# EAGLE schematic BT60-soldered (EAGLE 9.6.2)
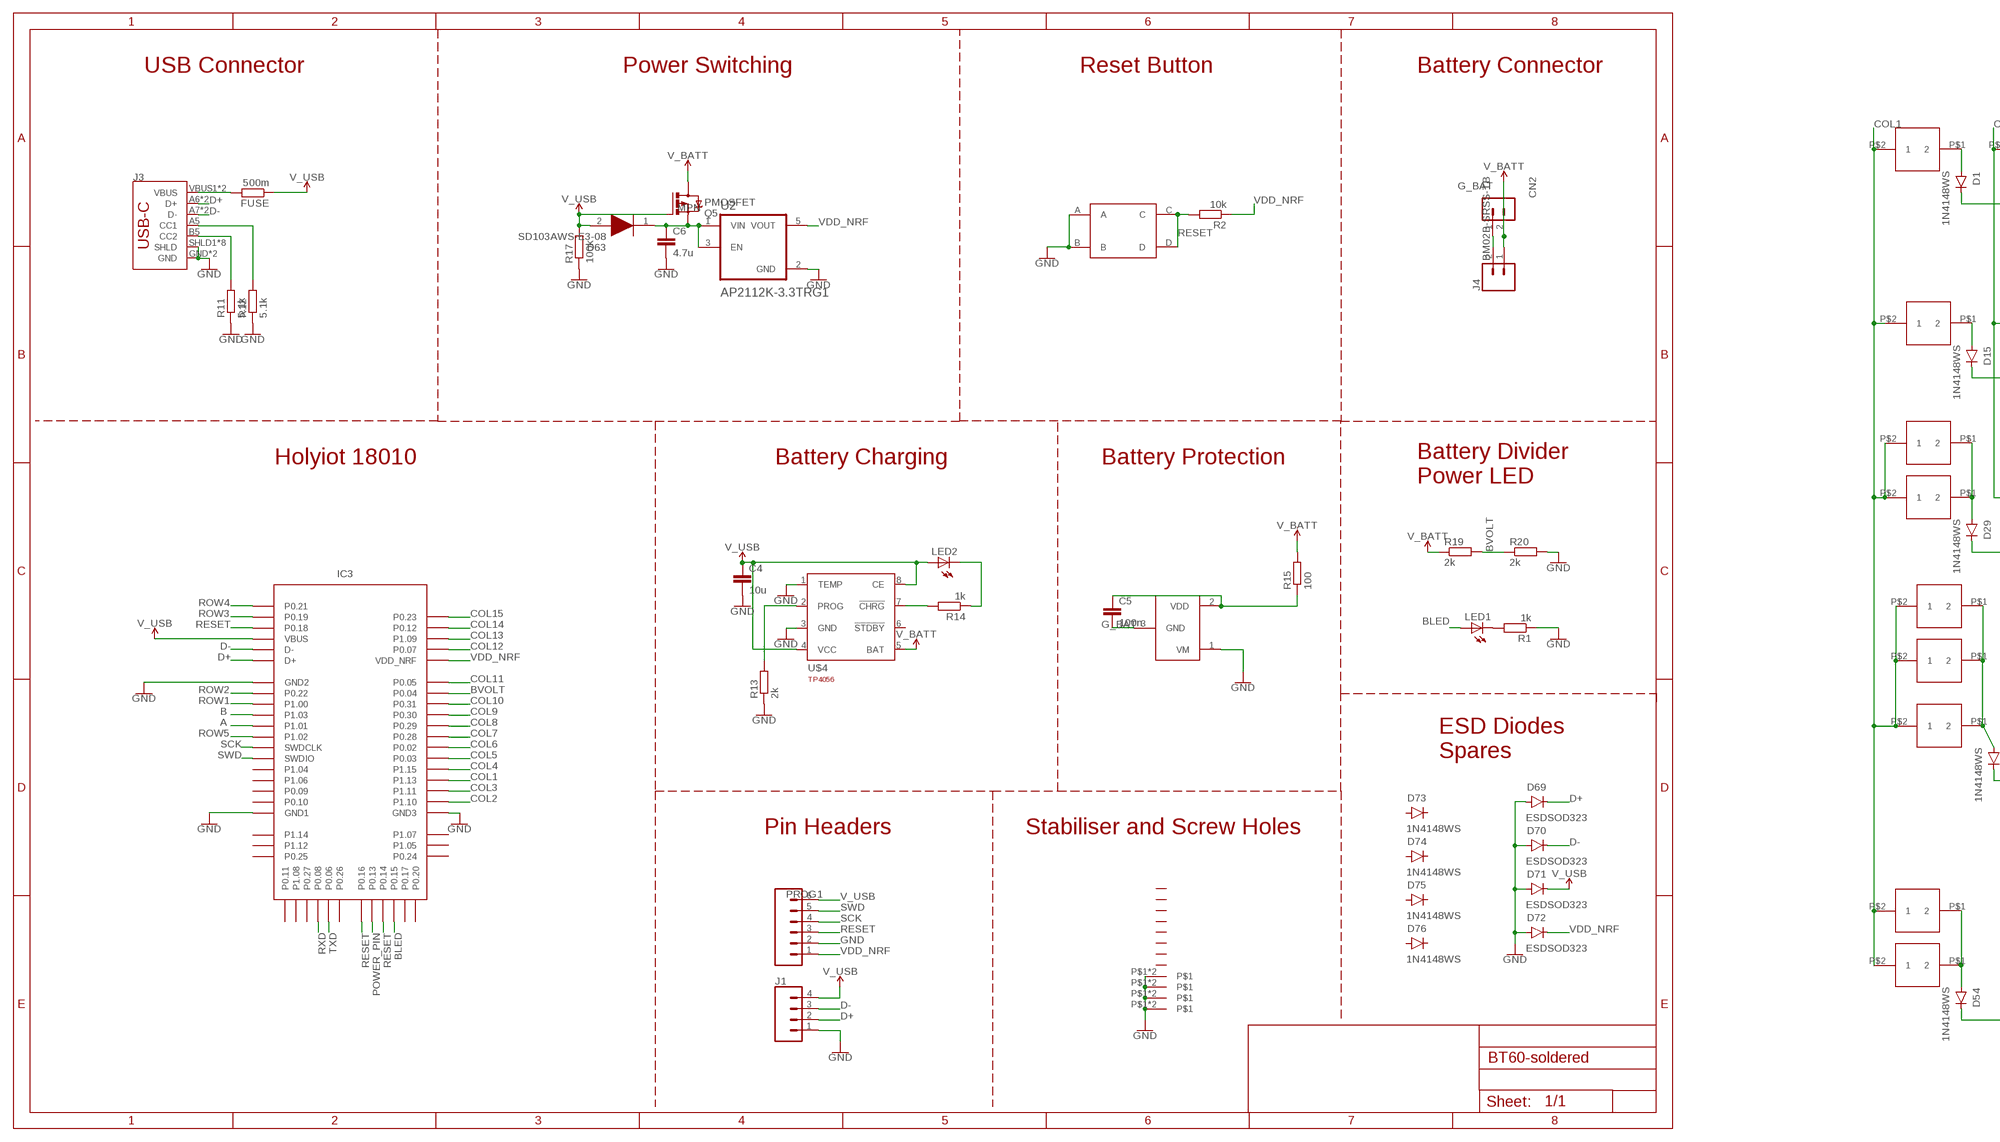
[diagram p0: schematic, sheet 1, part 1 of 2]
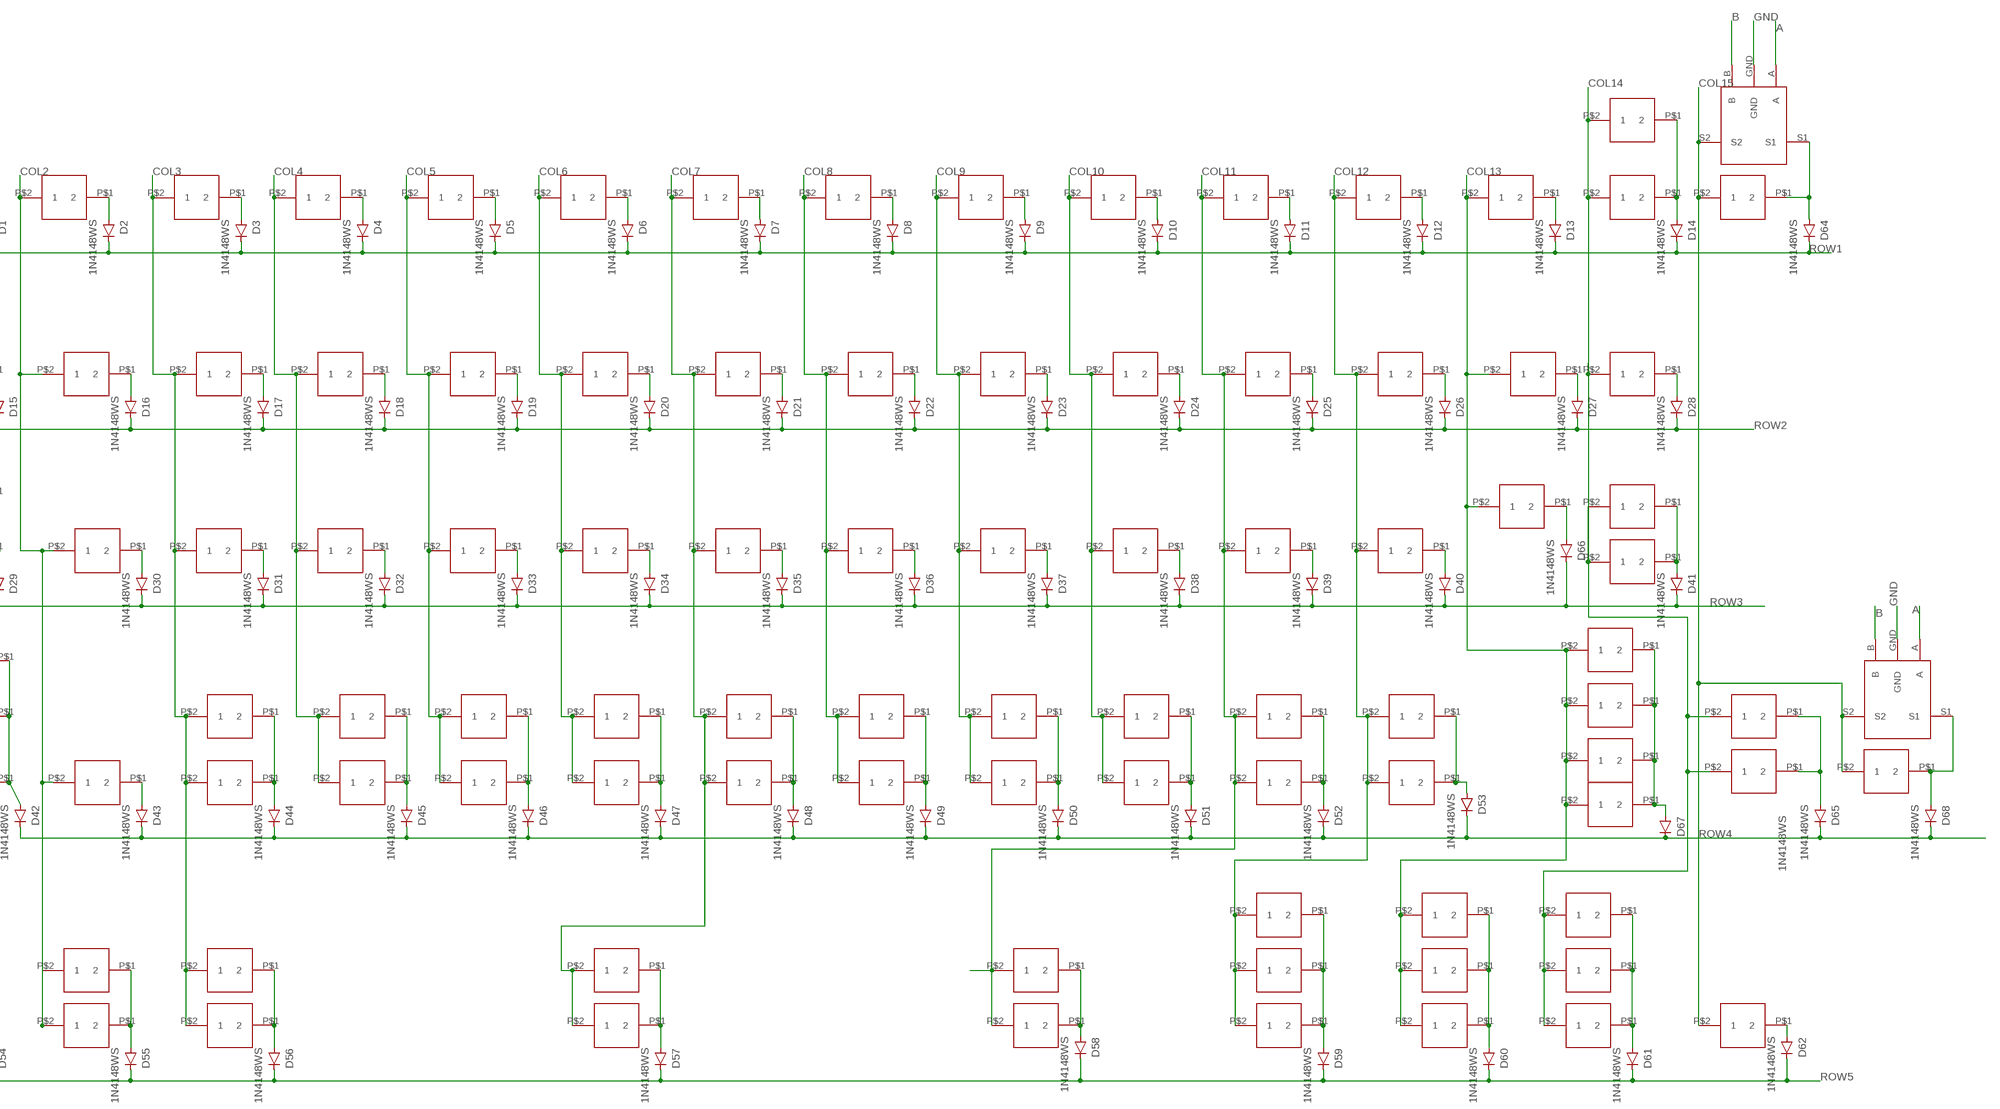
[diagram p1: schematic, sheet 1, part 2 of 2]

## Parts
0  CHERRY-SOLDER  [CHERRY-SOLDER]
1  CHERRY-SOLDER  [CHERRY-SOLDER]
1U_1  CHERRY-SOLDER  [CHERRY-SOLDER]
1U_2  CHERRY-SOLDER  [CHERRY-SOLDER]
1U_3  CHERRY-SOLDER  [CHERRY-SOLDER]
1U_4  CHERRY-SOLDER  [CHERRY-SOLDER]
1U_5  CHERRY-SOLDER  [CHERRY-SOLDER]
2  CHERRY-SOLDER  [CHERRY-SOLDER]
3  CHERRY-SOLDER  [CHERRY-SOLDER]
4  CHERRY-SOLDER  [CHERRY-SOLDER]
5  CHERRY-SOLDER  [CHERRY-SOLDER]
6  CHERRY-SOLDER  [CHERRY-SOLDER]
7  CHERRY-SOLDER  [CHERRY-SOLDER]
8  CHERRY-SOLDER  [CHERRY-SOLDER]
9  CHERRY-SOLDER  [CHERRY-SOLDER]
#_ISO  CHERRY-SOLDER  [CHERRY-SOLDER]
'  CHERRY-SOLDER  [CHERRY-SOLDER]
,  CHERRY-SOLDER  [CHERRY-SOLDER]
,_1  CHERRY-SOLDER  [CHERRY-SOLDER]
-  CHERRY-SOLDER  [CHERRY-SOLDER]
.  CHERRY-SOLDER  [CHERRY-SOLDER]
._1  CHERRY-SOLDER  [CHERRY-SOLDER]
/  CHERRY-SOLDER  [CHERRY-SOLDER]
/_1  CHERRY-SOLDER  [CHERRY-SOLDER]
=  CHERRY-SOLDER  [CHERRY-SOLDER]
[  CHERRY-SOLDER  [CHERRY-SOLDER]
\  CHERRY-SOLDER  [CHERRY-SOLDER]
]  CHERRY-SOLDER  [CHERRY-SOLDER]
A  CHERRY-SOLDER  [CHERRY-SOLDER]
B  CHERRY-SOLDER  [CHERRY-SOLDER]
B_1  CHERRY-SOLDER  [CHERRY-SOLDER]
BS  CHERRY-SOLDER  [CHERRY-SOLDER]
C  CHERRY-SOLDER  [CHERRY-SOLDER]
C4  10u  C-EUC0603  [C0603]
C5  100n  C-EUC0603  [C0603]
C6  4.7u  C-EUC0603  [C0603]
C_1  CHERRY-SOLDER  [CHERRY-SOLDER]
CAPS  CHERRY-SOLDER  [CHERRY-SOLDER]
CAPS_STEP  CHERRY-SOLDER  [CHERRY-SOLDER]
CN2  BM02B-SRSS-TB  [BM02B-SRSS-TB]
COLON  CHERRY-SOLDER  [CHERRY-SOLDER]
D  CHERRY-SOLDER  [CHERRY-SOLDER]
D1  1N4148WS  [SOD-323]
D2  1N4148WS  [SOD-323]
D3  1N4148WS  [SOD-323]
D4  1N4148WS  [SOD-323]
D5  1N4148WS  [SOD-323]
D6  1N4148WS  [SOD-323]
D7  1N4148WS  [SOD-323]
D8  1N4148WS  [SOD-323]
D9  1N4148WS  [SOD-323]
D10  1N4148WS  [SOD-323]
D11  1N4148WS  [SOD-323]
D12  1N4148WS  [SOD-323]
D13  1N4148WS  [SOD-323]
D14  1N4148WS  [SOD-323]
D15  1N4148WS  [SOD-323]
D16  1N4148WS  [SOD-323]
D17  1N4148WS  [SOD-323]
D18  1N4148WS  [SOD-323]
D19  1N4148WS  [SOD-323]
D20  1N4148WS  [SOD-323]
D21  1N4148WS  [SOD-323]
D22  1N4148WS  [SOD-323]
D23  1N4148WS  [SOD-323]
D24  1N4148WS  [SOD-323]
D25  1N4148WS  [SOD-323]
D26  1N4148WS  [SOD-323]
D27  1N4148WS  [SOD-323]
D28  1N4148WS  [SOD-323]
D29  1N4148WS  [SOD-323]
D30  1N4148WS  [SOD-323]
D31  1N4148WS  [SOD-323]
D32  1N4148WS  [SOD-323]
D33  1N4148WS  [SOD-323]
D34  1N4148WS  [SOD-323]
D35  1N4148WS  [SOD-323]
D36  1N4148WS  [SOD-323]
D37  1N4148WS  [SOD-323]
D38  1N4148WS  [SOD-323]
D39  1N4148WS  [SOD-323]
D40  1N4148WS  [SOD-323]
D41  1N4148WS  [SOD-323]
D42  1N4148WS  [SOD-323]
D43  1N4148WS  [SOD-323]
D44  1N4148WS  [SOD-323]
D45  1N4148WS  [SOD-323]
D46  1N4148WS  [SOD-323]
D47  1N4148WS  [SOD-323]
D48  1N4148WS  [SOD-323]
D49  1N4148WS  [SOD-323]
D50  1N4148WS  [SOD-323]
D51  1N4148WS  [SOD-323]
D52  1N4148WS  [SOD-323]
D53  1N4148WS  [SOD-323]
D54  1N4148WS  [SOD-323]
D55  1N4148WS  [SOD-323]
D56  1N4148WS  [SOD-323]
D57  1N4148WS  [SOD-323]
D58  1N4148WS  [SOD-323]
D59  1N4148WS  [SOD-323]
D60  1N4148WS  [SOD-323]
D61  1N4148WS  [SOD-323]
D62  1N4148WS  [SOD-323]
D63  SD103AWS-E3-08  [SOD2713X115N]
D64  1N4148WS  [SOD-323]
D65  1N4148WS  [SOD-323]
D66  1N4148WS  [SOD-323]
D67  1N4148WS  [SOD-323]
D68  1N4148WS  [SOD-323]
D69  ESDSOD323  [SOD-323]
D70  ESDSOD323  [SOD-323]
D71  ESDSOD323  [SOD-323]
D72  ESDSOD323  [SOD-323]
D73  1N4148WS  [SOD-323]
D74  1N4148WS  [SOD-323]
D75  1N4148WS  [SOD-323]
D76  1N4148WS  [SOD-323]
E  CHERRY-SOLDER  [CHERRY-SOLDER]
ENTER  CHERRY-SOLDER  [CHERRY-SOLDER]
ESC  CHERRY-SOLDER  [CHERRY-SOLDER]
EXTRA_1U_LEFT  CHERRY-SOLDER  [CHERRY-SOLDER]
F  CHERRY-SOLDER  [CHERRY-SOLDER]
FN  CHERRY-SOLDER  [CHERRY-SOLDER]
FUSE  500m  R-EU_R0603  [R0603]
G  CHERRY-SOLDER  [CHERRY-SOLDER]
H  CHERRY-SOLDER  [CHERRY-SOLDER]
I  CHERRY-SOLDER  [CHERRY-SOLDER]
IC3  HOLYIOT_18010  [PCBCOMPONENT_1]
ISO_#  CHERRY-SOLDER  [CHERRY-SOLDER]
ISO_ENTER  CHERRY-SOLDER  [CHERRY-SOLDER]
J  CHERRY-SOLDER  [CHERRY-SOLDER]
J1  CONN_041X04_NO_SILK  [1X04_NO_SILK]
J3  SPARKFUN-CONNECTORS_USB_C16PIN  [SPARKFUN-CONNECTORS_USB-C-16P]
J4  CONN_02  [1X02]
K  CHERRY-SOLDER  [CHERRY-SOLDER]
L  CHERRY-SOLDER  [CHERRY-SOLDER]
L_1.25U_SHIFT  CHERRY-SOLDER  [CHERRY-SOLDER]
L_2U_SHIFT  CHERRY-SOLDER  [CHERRY-SOLDER]
L_SHIFT  CHERRY-SOLDER  [CHERRY-SOLDER]
LALT  CHERRY-SOLDER  [CHERRY-SOLDER]
LALT_1.5U  CHERRY-SOLDER  [CHERRY-SOLDER]
LCTRL  CHERRY-SOLDER  [CHERRY-SOLDER]
LCTRL_1.5U  CHERRY-SOLDER  [CHERRY-SOLDER]
LED1  LEDCHIPLED_0805  [CHIPLED_0805]
LED2  LEDCHIPLED_0805  [CHIPLED_0805]
LWIN  CHERRY-SOLDER  [CHERRY-SOLDER]
LWIN_1U  CHERRY-SOLDER  [CHERRY-SOLDER]
M  CHERRY-SOLDER  [CHERRY-SOLDER]
M_1  CHERRY-SOLDER  [CHERRY-SOLDER]
MENU  CHERRY-SOLDER  [CHERRY-SOLDER]
MENU_1U  CHERRY-SOLDER  [CHERRY-SOLDER]
N  CHERRY-SOLDER  [CHERRY-SOLDER]
N_1  CHERRY-SOLDER  [CHERRY-SOLDER]
O  CHERRY-SOLDER  [CHERRY-SOLDER]
P  CHERRY-SOLDER  [CHERRY-SOLDER]
PROG1  CONN_06NO_SILK_FEMALE_PTH  [1X06_NO_SILK]
Q  CHERRY-SOLDER  [CHERRY-SOLDER]
Q5  PMOSFET  PMOSFET_SOT23  [SOT23]
R  CHERRY-SOLDER  [CHERRY-SOLDER]
R1  1k  R-EU_R0603  [R0603]
R2  10k  R-EU_R0603  [R0603]
R11  5.1k  R-EU_R0603  [R0603]
R12  5.1k  R-EU_R0603  [R0603]
R13  2k  R-EU_R0603  [R0603]
R14  1k  R-EU_R0603  [R0603]
R15  100  R-EU_R0603  [R0603]
R17  100k  R-EU_R0603  [R0603]
R19  2k  R-EU_R0603  [R0603]
R20  2k  R-EU_R0603  [R0603]
R_ALT_1.5  CHERRY-SOLDER  [CHERRY-SOLDER]
R_CTRL_1.5U  CHERRY-SOLDER  [CHERRY-SOLDER]
R_SHIFT  CHERRY-SOLDER  [CHERRY-SOLDER]
R_SHIFT_1.75U_LEFT  CHERRY-SOLDER  [CHERRY-SOLDER]
R_SHIFT_1.75U_RIGHT  CHERRY-SOLDER  [CHERRY-SOLDER]
RALT  CHERRY-SOLDER  [CHERRY-SOLDER]
RCTRL  CHERRY-SOLDER  [CHERRY-SOLDER]
S  CHERRY-SOLDER  [CHERRY-SOLDER]
SPACE_6.25U  CHERRY-SOLDER  [CHERRY-SOLDER]
SPACE_7U  CHERRY-SOLDER  [CHERRY-SOLDER]
SPLIT_BS_1  CHERRY-SOLDER  [CHERRY-SOLDER]
SPLIT_BS_2  CHERRY-SOLDER  [CHERRY-SOLDER]
T  CHERRY-SOLDER  [CHERRY-SOLDER]
TAB  CHERRY-SOLDER  [CHERRY-SOLDER]
U  CHERRY-SOLDER  [CHERRY-SOLDER]
U2  AP2112K-3.3TRG1  [SOT95P285X140-5N]
U$1  CHERRY-ENCODER  [CHERRY-ENCODER]
U$2  CHERRY-ENCODER  [CHERRY-ENCODER]
U$3  XB3303ASOT23  [SOT23-3]
U$4  TP4056SOI8  [SOIC8]
U$62  SMD-BUTTON  [SMD-BUTTON]
U$64  2.5MM_ELONGATED  [2.5MM_ELONGATED]
U$65  2.5MM_ELONGATED  [2.5MM_ELONGATED]
U$66  2.5MM_ELONGATED  [2.5MM_ELONGATED]
U$67  2.5MM_ELONGATED  [2.5MM_ELONGATED]
U$68  STAB-2U  [STAB-2U]
U$69  STAB-2U  [STAB-2U]
U$70  STAB-2U  [STAB-2U]
U$71  STAB-2U  [STAB-2U]
U$72  STAB-6U  [STAB-6.25U]
U$83  STAB-2U  [STAB-2U]
U$91  STAB-7U  [STAB-7U]
U$108  STAB-2U  [STAB-2U]
UP  CHERRY-SOLDER  [CHERRY-SOLDER]
V  CHERRY-SOLDER  [CHERRY-SOLDER]
V_1  CHERRY-SOLDER  [CHERRY-SOLDER]
W  CHERRY-SOLDER  [CHERRY-SOLDER]
X  CHERRY-SOLDER  [CHERRY-SOLDER]
X5U_1  CHERRY-SOLDER  [CHERRY-SOLDER]
X5U_2  CHERRY-SOLDER  [CHERRY-SOLDER]
X_1  CHERRY-SOLDER  [CHERRY-SOLDER]
Y  CHERRY-SOLDER  [CHERRY-SOLDER]
Z  CHERRY-SOLDER  [CHERRY-SOLDER]
Z_1  CHERRY-SOLDER  [CHERRY-SOLDER]

## Nets
A: IC3.P1.01 U$1.A U$2.A
B: IC3.P1.03 U$1.B U$2.B
BLED: IC3.P0.15 LED1.A
BVOLT: IC3.P0.04 R19.2 R20.1
COL1: CAPS.P$2 CAPS_STEP.P$2 ESC.P$2 IC3.P1.13 L_1.25U_SHIFT.P$2 L_2U_SHIFT.P$2 L_SHIFT.P$2 LCTRL.P$2 LCTRL_1.5U.P$2 TAB.P$2
COL2: 1.P$2 #_ISO.P$2 A.P$2 IC3.P1.10 LWIN.P$2 LWIN_1U.P$2 Q.P$2
COL3: 2.P$2 IC3.P1.11 LALT.P$2 LALT_1.5U.P$2 S.P$2 W.P$2 Z.P$2 Z_1.P$2
COL4: 3.P$2 D.P$2 E.P$2 IC3.P1.15 X.P$2 X_1.P$2
COL5: 4.P$2 C.P$2 C_1.P$2 F.P$2 IC3.P0.03 R.P$2
COL6: 5.P$2 G.P$2 IC3.P0.02 T.P$2 V.P$2 V_1.P$2
COL7: 6.P$2 B.P$2 B_1.P$2 H.P$2 IC3.P0.28 SPACE_6.25U.P$2 SPACE_7U.P$2 Y.P$2
COL8: 7.P$2 IC3.P0.29 J.P$2 N.P$2 N_1.P$2 U.P$2
COL9: 8.P$2 I.P$2 IC3.P0.30 K.P$2 M.P$2 M_1.P$2
COL10: 9.P$2 ,.P$2 ,_1.P$2 IC3.P0.31 L.P$2 O.P$2
COL11: 0.P$2 1U_1.P$2 ..P$2 ._1.P$2 COLON.P$2 IC3.P0.05 P.P$2 RALT.P$2
COL12: 1U_2.P$2 '.P$2 -.P$2 /.P$2 /_1.P$2 [.P$2 IC3.P0.07 MENU.P$2 R_ALT_1.5.P$2
COL13: 1U_3.P$2 =.P$2 ].P$2 EXTRA_1U_LEFT.P$2 IC3.P1.09 ISO_#.P$2 MENU_1U.P$2 R_SHIFT.P$2 R_SHIFT_1.75U_LEFT.P$2 RCTRL.P$2 UP.P$2
COL14: 1U_4.P$2 \.P$2 BS.P$2 ENTER.P$2 FN.P$2 IC3.P0.12 ISO_ENTER.P$2 R_CTRL_1.5U.P$2 R_SHIFT_1.75U_RIGHT.P$2 SPLIT_BS_1.P$2 X5U_1.P$2
COL15: 1U_5.P$2 IC3.P0.23 SPLIT_BS_2.P$2 U$1.S2 U$2.S2 X5U_2.P$2
D+: D69.C IC3.D+ J1.2 J3.A6(D+) J3.B6(D+)
D-: D70.C IC3.D- J1.3 J3.A7(D-) J3.B7(D-)
G_BAT: C5.2 CN2.1 J4.2 U$3.3(GND)
GND: C4.2 C6.2 D69.A D70.A D71.A D72.A IC3.GND1(GND2) IC3.GND2(GND3) IC3.GND(GND1) J1.1 J3.GND J3.GND2(GND) J3.SHLD1(SHLD) J3.SHLD2(SHLD) J3.SHLD3(SHLD) J3.SHLD4(SHLD) J3.SHLD5(SHLD) J3.SHLD6(SHLD) J3.SHLD7(SHLD) J3.SHLD8(SHLD) PROG1.2 R1.1 R11.1 R12.1 R13.1 R17.1 R20.2 U2.2(GND) U$1.GND U$2.GND U$3.1(VM) U$4.1(TEMP) U$4.3(GND) U$62.A U$62.B U$64.P$1 U$64.P$2 U$65.P$1 U$65.P$2 U$66.P$1 U$66.P$2 U$67.P$1 U$67.P$2
N$1: D1.A ESC.P$1
N$2: LED1.C R1.2
N$3: 1U_5.P$1 D62.A
N$4: =.P$1 D13.A
N$5: -.P$1 D12.A
N$6: 0.P$1 D11.A
N$7: 9.P$1 D10.A
N$8: 8.P$1 D9.A
N$9: 7.P$1 D8.A
N$10: 6.P$1 D7.A
N$11: 5.P$1 D6.A
N$12: 4.P$1 D5.A
N$13: 3.P$1 D4.A
N$14: 2.P$1 D3.A
N$15: 1.P$1 D2.A
N$16: D15.A TAB.P$1
N$17: D45.A X.P$1 X_1.P$1
N$18: \.P$1 D28.A
N$19: ].P$1 D27.A
N$20: [.P$1 D26.A
N$21: D25.A P.P$1
N$22: D24.A O.P$1
N$23: D23.A I.P$1
N$24: D22.A U.P$1
N$25: D21.A Y.P$1
N$26: D20.A T.P$1
N$27: D19.A R.P$1
N$28: D18.A E.P$1
N$29: D17.A W.P$1
N$30: D16.A Q.P$1
N$31: D47.A V.P$1 V_1.P$1
N$32: ,.P$1 ,_1.P$1 D51.A
N$33: D41.A ENTER.P$1 ISO_ENTER.P$1
N$34: '.P$1 D40.A
N$35: COLON.P$1 D39.A
N$36: D38.A L.P$1
N$37: D37.A K.P$1
N$38: D36.A J.P$1
N$39: D35.A H.P$1
N$40: D34.A G.P$1
N$41: D33.A F.P$1
N$42: D32.A D.P$1
N$43: D31.A S.P$1
N$44: A.P$1 D30.A
N$45: D42.A L_1.25U_SHIFT.P$1 L_2U_SHIFT.P$1 L_SHIFT.P$1
N$46: ..P$1 ._1.P$1 D52.A
N$47: D67.A EXTRA_1U_LEFT.P$1 R_SHIFT.P$1 R_SHIFT_1.75U_LEFT.P$1 UP.P$1
N$48: D68.A U$2.S1 X5U_2.P$1
N$49: D64.A SPLIT_BS_2.P$1 U$1.S1
N$50: C5.1 R15.1 U$3.2(VDD)
N$52: #_ISO.P$1 D43.A
N$53: D44.A Z.P$1 Z_1.P$1
N$54: B.P$1 B_1.P$1 D48.A
N$55: C.P$1 C_1.P$1 D46.A
N$56: D49.A N.P$1 N_1.P$1
N$57: D50.A M.P$1 M_1.P$1
N$58: D54.A LCTRL.P$1 LCTRL_1.5U.P$1
N$59: /.P$1 /_1.P$1 D53.A
N$60: 1U_4.P$1 D61.A FN.P$1 R_CTRL_1.5U.P$1
N$61: 1U_3.P$1 D60.A MENU_1U.P$1 RCTRL.P$1
N$62: 1U_2.P$1 D59.A MENU.P$1 R_ALT_1.5.P$1
N$63: 1U_1.P$1 D58.A RALT.P$1
N$64: D57.A SPACE_6.25U.P$1 SPACE_7U.P$1
N$65: D56.A LALT.P$1 LALT_1.5U.P$1
N$66: D55.A LWIN.P$1 LWIN_1U.P$1
N$67: FUSE.2 J3.VBUS1(VBUS) J3.VBUS2(VBUS)
N$68: BS.P$1 D14.A SPLIT_BS_1.P$1
N$71: D66.A ISO_#.P$1
N$72: J3.B5(CC2) R11.2
N$73: J3.A5(CC1) R12.2
N$74: R13.2 U$4.2(PROG)
N$75: LED2.C R14.1
N$76: R14.2 U$4.7(!CHRG)
N$81: C6.1 D63.1(K) Q5.2(S) U2.1(VIN) U2.3(EN)
N$82: CAPS.P$1 CAPS_STEP.P$1 D29.A
N$83: D65.A R_SHIFT_1.75U_RIGHT.P$1 X5U_1.P$1
POWER_PIN: IC3.P0.13
RESET: IC3.P0.14 IC3.P0.16 IC3.P0.18 PROG1.3 R2.2 U$62.C U$62.D
ROW1: D1.C D2.C D3.C D4.C D5.C D6.C D7.C D8.C D9.C D10.C D11.C D12.C D13.C D14.C D64.C IC3.P1.00
ROW2: D15.C D16.C D17.C D18.C D19.C D20.C D21.C D22.C D23.C D24.C D25.C D26.C D27.C D28.C IC3.P0.22
ROW3: D29.C D30.C D31.C D32.C D33.C D34.C D35.C D36.C D37.C D38.C D39.C D40.C D41.C D66.C IC3.P0.19
ROW4: D42.C D43.C D44.C D45.C D46.C D47.C D48.C D49.C D50.C D51.C D52.C D53.C D65.C D67.C D68.C IC3.P0.21
ROW5: D54.C D55.C D56.C D57.C D58.C D59.C D60.C D61.C D62.C IC3.P1.02
RXD: IC3.P0.08
SCK: IC3.SWDCLK PROG1.4
SWD: IC3.SWDIO PROG1.5
TXD: IC3.P0.06
V_BATT: CN2.2 J4.1 Q5.3(D) R15.2 R19.1 U$4.5(BAT)
V_USB: C4.1 D63.2(A) D71.C FUSE.1 IC3.VBUS J1.4 LED2.A PROG1.6 Q5.1(G) R17.2 U$4.4(VCC) U$4.8(CE)
VDD_NRF: D72.C IC3.VDD_NRF PROG1.1 R2.1 U2.5(VOUT)
Unconnected: D73.A D73.C D74.A D74.C D75.A D75.C D76.A D76.C IC3.P0.09 IC3.P0.10 IC3.P0.11 IC3.P0.17 IC3.P0.20 IC3.P0.24 IC3.P0.25 IC3.P0.26 IC3.P0.27 IC3.P1.04 IC3.P1.05 IC3.P1.06 IC3.P1.07 IC3.P1.08 IC3.P1.12 IC3.P1.14 U$4.6(!STDBY)

## Notes on the sheet
- USB Connector | Power Switching | Reset Button | Battery Connector
- Holyiot 18010 | Battery Charging | Battery Protection
- Battery Divider
  Power LED
- ESD Diodes
  Spares
- Pin Headers | Stabiliser and Screw Holes

## Library data of the parts
0 1 1U_1-1U_5 2-9 #_ISO ' , ,_1 - . ._1 / /_1 = [ \ ] A B B_1 BS C C_1 CAPS CAPS_STEP COLON D E ENTER ESC EXTRA_1U_LEFT F FN G H I ISO_# ISO_ENTER J K L L_1.25U_SHIFT L_2U_SHIFT L_SHIFT LALT LALT_1.5U LCTRL LCTRL_1.5U LWIN LWIN_1U M M_1 MENU MENU_1U N N_1 O P Q R R_ALT_1.5 R_CTRL_1.5U R_SHIFT R_SHIFT_1.75U_LEFT R_SHIFT_1.75U_RIGHT RALT RCTRL S SPACE_6.25U SPACE_7U SPLIT_BS_1 SPLIT_BS_2 T TAB U UP V V_1 W X X5U_1 X5U_2 X_1 Y Z Z_1 = Volume_V1:CHERRY-SOLDER
C4-C6 = resistor:C-EU: CAPACITOR, European symbol
CN2 = con-JST SH:BM02B-SRSS: JST SH series header 1.00mm pitch disconnectable crimp style connectors, vertical (side entry type), 2 pins
D1-D62 D64-D68 D73-D76 = Diodes:1N4148WS: DIODE GEN PURP 75V 150MA SOD323F Manufacturer's datasheet <https://www.onsemi.com/pub/Collateral/1N914BWS-D.pdf>; CREATED_BY: PCBLayout.com; DIGIKEY_PART_NUMBER: 1N4148WSFSTR-ND; MANUFACTURER: Diodes Incorporated; MPN: 1N4148WS; PACKAGE: SOD-323
D63 = SD103AWS-E3-08:SD103AWS-E3-08: Vishay SD103AWS-E3-08, SMT Schottky Diode, 40V 350mA, 10ns, 2-Pin SOD-323 Source: Datasheet <http://www.vishay.com/docs/85682/sd103aws.pdf>; ARROW_PART_NUMBER: SD103AWS-E3-08; ARROW_PRICE-STOCK: https://www.arrow.com/en/products/sd103aws-e3-08/vishay; DESCRIPTION: Vishay SD103AWS-E3-08, SMT Schottky Diode, 40V 350mA, 10ns, 2-Pin SOD-323; HEIGHT: 1.15mm; MANUFACTURER_NAME: Vishay; MANUFACTURER_PART_NUMBER: SD103AWS-E3-08; MOUSER_PART_NUMBER: 78-SD103AWS-E3-08; MOUSER_PRICE-STOCK: https://www.mouser.co.uk/ProductDetail/Vishay-Semiconductors/SD103AWS-E3-08?qs=S660mHfF5o1xcba7ic5A%252BA%3D%3D
D69-D72 = Volume_V1:ESDSOD323: DIODE GEN PURP 75V 150MA SOD323F Manufacturer's datasheet <https://www.onsemi.com/pub/Collateral/1N914BWS-D.pdf>; CREATED_BY: PCBLayout.com; MANUFACTURER: Diodes Incorporated; PACKAGE: SOD-323
FUSE R1 R2 R11-R15 R17 R19 R20 = rcl:R-EU_: RESISTOR, European symbol; SPICEPREFIX: R
IC3 = HOLYIOT-18010-VER1.0-0.8MM:HOLYIOT_18010
J1 = SparkFun-Connectors:CONN_04: Multi connection point. Often used as Generic Header-pin footprint for 0.1 inch spaced/style header connections On any of the 0.1 inch spaced packages, you can populate with these: Break Away Headers - Straight <https://www.sparkfun.com/products/116> (PRT-00116) Break Away Male Headers - Right Angle <https://www.sparkfun.com/products/553> (PRT-00553) Female Headers <https://www.sparkfun.com/products/115> (PRT-00115) Break Away Headers - Machine Pin <https://www.sparkfun.com/products/117> (PRT-00117) Break Away Female Headers - Swiss Machine Pin <https://www.sparkfun.com/products/743> (PRT-00743) For SCREWTERMINALS and SPRING TERMINALS visit here: Screw Terimnals on SparkFun.com <https://www.sparkfun.com/search/results?term=Screw+Terminals> (5mm/3.5mm/2.54mm spacing) This device is also useful as a general connection point to wire up your design to another part of your project. Our various solder wires solder well into these plated through hole pads. Hook-Up Wire - Assortment (Stranded, 22 AWG) <https://www.sparkfun.com/products/11375> (PRT-11375) Hook-Up Wire - Assortment (Solid Core, 22 AWG) <https://www.sparkfun.com/products/11367> (PRT-11367) View the entire wire category on our website here <https://www.sparkfun.com/categories/141> Special notes: Molex polarized connector foot print use with SKU : PRT-08231 with associated crimp pins and housings. 1MM SMD Version SKU: PRT-10208; PROD_ID: CONN-09696
J3 = USB-C-Breakout:SPARKFUN-CONNECTORS_USB_C: USB Type C 16Pin Connector Super Speed pins not available on the 16-pin purely SMD connector so this part is best for USB 2.0 implementations. D1 and D2 are tied together enabling D+/- no matter which way the cable is plugged into the connector. The two channel configuration pins (CC1/2) are exposed. These are normally connected to ground via 5.1k resistors but can be reconfigured for high current/high power applications.; PROD_ID: CONN-14122
J4 = SparkFun-Connectors:CONN_02: Multi connection point. Often used as Generic Header-pin footprint for 0.1 inch spaced/style header connections On any of the 0.1 inch spaced packages, you can populate with these: Break Away Headers - Straight <https://www.sparkfun.com/products/116> (PRT-00116) Break Away Male Headers - Right Angle <https://www.sparkfun.com/products/553> (PRT-00553) Female Headers <https://www.sparkfun.com/products/115> (PRT-00115) Break Away Headers - Machine Pin <https://www.sparkfun.com/products/117> (PRT-00117) Break Away Female Headers - Swiss Machine Pin <https://www.sparkfun.com/products/743> (PRT-00743) For SCREWTERMINALS and SPRING TERMINALS visit here: Screw Terimnals on SparkFun.com <https://www.sparkfun.com/search/results?term=Screw+Terminals> (5mm/3.5mm/2.54mm spacing) This device is also useful as a general connection point to wire up your design to another part of your project. Our various solder wires solder well into these plated through hole pads. Hook-Up Wire - Assortment (Stranded, 22 AWG) <https://www.sparkfun.com/products/11375> (PRT-11375) Hook-Up Wire - Assortment (Solid Core, 22 AWG) <https://www.sparkfun.com/products/11367> (PRT-11367) View the entire wire category on our website here <https://www.sparkfun.com/categories/141> Special notes: Molex polarized connector foot print use with: PRT-08233 with associated crimp pins and housings. 2.54_SCREWTERM for use with PRT-10571. 3.5mm Screw Terminal footprints for PRT-08084 5mm Screw Terminal footprints for use with PRT-08432
LED1 LED2 = adafruit:LED: LED OSRAM: - CHIPLED LG R971, LG N971, LY N971, LG Q971, LY Q971, LO R971, LY R971 LH N974, LH R974 LS Q976, LO Q976, LY Q976 LO Q996 - Hyper CHIPLED LW Q18S LB Q993, LB Q99A, LB R99A - SideLED LS A670, LO A670, LY A670, LG A670, LP A670 LB A673, LV A673, LT A673, LW A673 LH A674 LY A675 LS A676, LA A676, LO A676, LY A676, LW A676 LS A679, LY A679, LG A679 - Hyper Micro SIDELED® LS Y876, LA Y876, LO Y876, LY Y876 LT Y87S - SmartLED LW L88C, LW L88S LB L89C, LB L89S, LG L890 LS L89K, LO L89K, LY L89K LS L896, LA L896, LO L896, LY L896 - TOPLED LS T670, LO T670, LY T670, LG T670, LP T670 LSG T670, LSP T670, LSY T670, LOP T670, LYG T670 LG T671, LOG T671, LSG T671 LB T673, LV T673, LT T673, LW T673 LH T674 LS T676, LA T676, LO T676, LY T676, LB T676, LH T676, LSB T676, LW T676 LB T67C, LV T67C, LT T67C, LS T67K, LO T67K, LY T67K, LW E67C LS E67B, LA E67B, LO E67B, LY E67B, LB E67C, LV E67C, LT E67C LW T67C LS T679, LY T679, LG T679 LS T770, LO T770, LY T770, LG T770, LP T770 LB T773, LV T773, LT T773, LW T773 LH T774 LS E675, LA E675, LY E675, LS T675 LS T776, LA T776, LO T776, LY T776, LB T776 LHGB T686 LT T68C, LB T68C - Hyper Mini TOPLED® LB M676 - Mini TOPLED Santana® LG M470 LS M47K, LO M47K, LY M47K Source: http://www.osram.convergy.de/
PROG1 = SparkFun-Connectors:CONN_06: Multi connection point. Often used as Generic Header-pin footprint for 0.1 inch spaced/style header connections On any of the 0.1 inch spaced packages, you can populate with these: Break Away Headers - Straight <https://www.sparkfun.com/products/116> (PRT-00116) Break Away Male Headers - Right Angle <https://www.sparkfun.com/products/553> (PRT-00553) Female Headers <https://www.sparkfun.com/products/115> (PRT-00115) Break Away Headers - Machine Pin <https://www.sparkfun.com/products/117> (PRT-00117) Break Away Female Headers - Swiss Machine Pin <https://www.sparkfun.com/products/743> (PRT-00743) Arduino Stackable Header - 6 Pin <https://www.sparkfun.com/products/9280> (PRT-09280) For SCREWTERMINALS and SPRING TERMINALS visit here: Screw Terimnals on SparkFun.com <https://www.sparkfun.com/search/results?term=Screw+Terminals> (5mm/3.5mm/2.54mm spacing) This device is also useful as a general connection point to wire up your design to another part of your project. Our various solder wires solder well into these plated through hole pads. Hook-Up Wire - Assortment (Stranded, 22 AWG) <https://www.sparkfun.com/products/11375> (PRT-11375) Hook-Up Wire - Assortment (Solid Core, 22 AWG) <https://www.sparkfun.com/products/11367> (PRT-11367) View the entire wire category on our website here <https://www.sparkfun.com/categories/141>; PROD_ID: CONN-08437
Q5 = Transistor:PMOSFET: P-Channel MOSFET - Generic; CATEGORY: Transistor; MPN: SL2301S; SUB-CATEGORY: MOSFET; TYPE: P-Channel
U2 = AP2112K-3.3TRG1:AP2112K-3.3TRG1: AP2112 Series 0.6 A 3.3 V Fixed Output SMT LDO Linear Regulator - SOT23-5 Check prices <https://pricing.snapeda.com/parts/AP2112K-3.3TRG1/Diodes%20Inc./view-part?ref=eda>; AVAILABILITY: Good; DESCRIPTION: Linear Voltage Regulator IC 1 Output 600mA SOT-25; MF: Diodes Inc.; MP: AP2112K-3.3TRG1; PACKAGE: SOT-753 Diodes Inc.; PRICE: None; PURCHASE-URL: https://pricing.snapeda.com/search/part/AP2112K-3.3TRG1/?ref=eda
U$1 U$2 = Volume_V1:CHERRY-ENCODER
U$3 = Volume_V1:XB3303A
U$4 = TP4056:TP4056: TP4056 Data sheet <http://goo.gl/J7k8TF> Dave.Calaway Eagle Library <https://goo.gl/Muy1Tr>
U$62 = Volume_V1:SMD-BUTTON
U$64-U$67 = Volume_V1:2.5MM_ELONGATED
U$68-U$71 U$83 U$108 = Volume_V1:STAB-2U
U$72 = Volume_V1:STAB-6U
U$91 = Volume_V1:STAB-7U